# Altium schematic sheet ESC_D.SchDoc
size A3; SheetNumber: 10; SheetTotal: 10
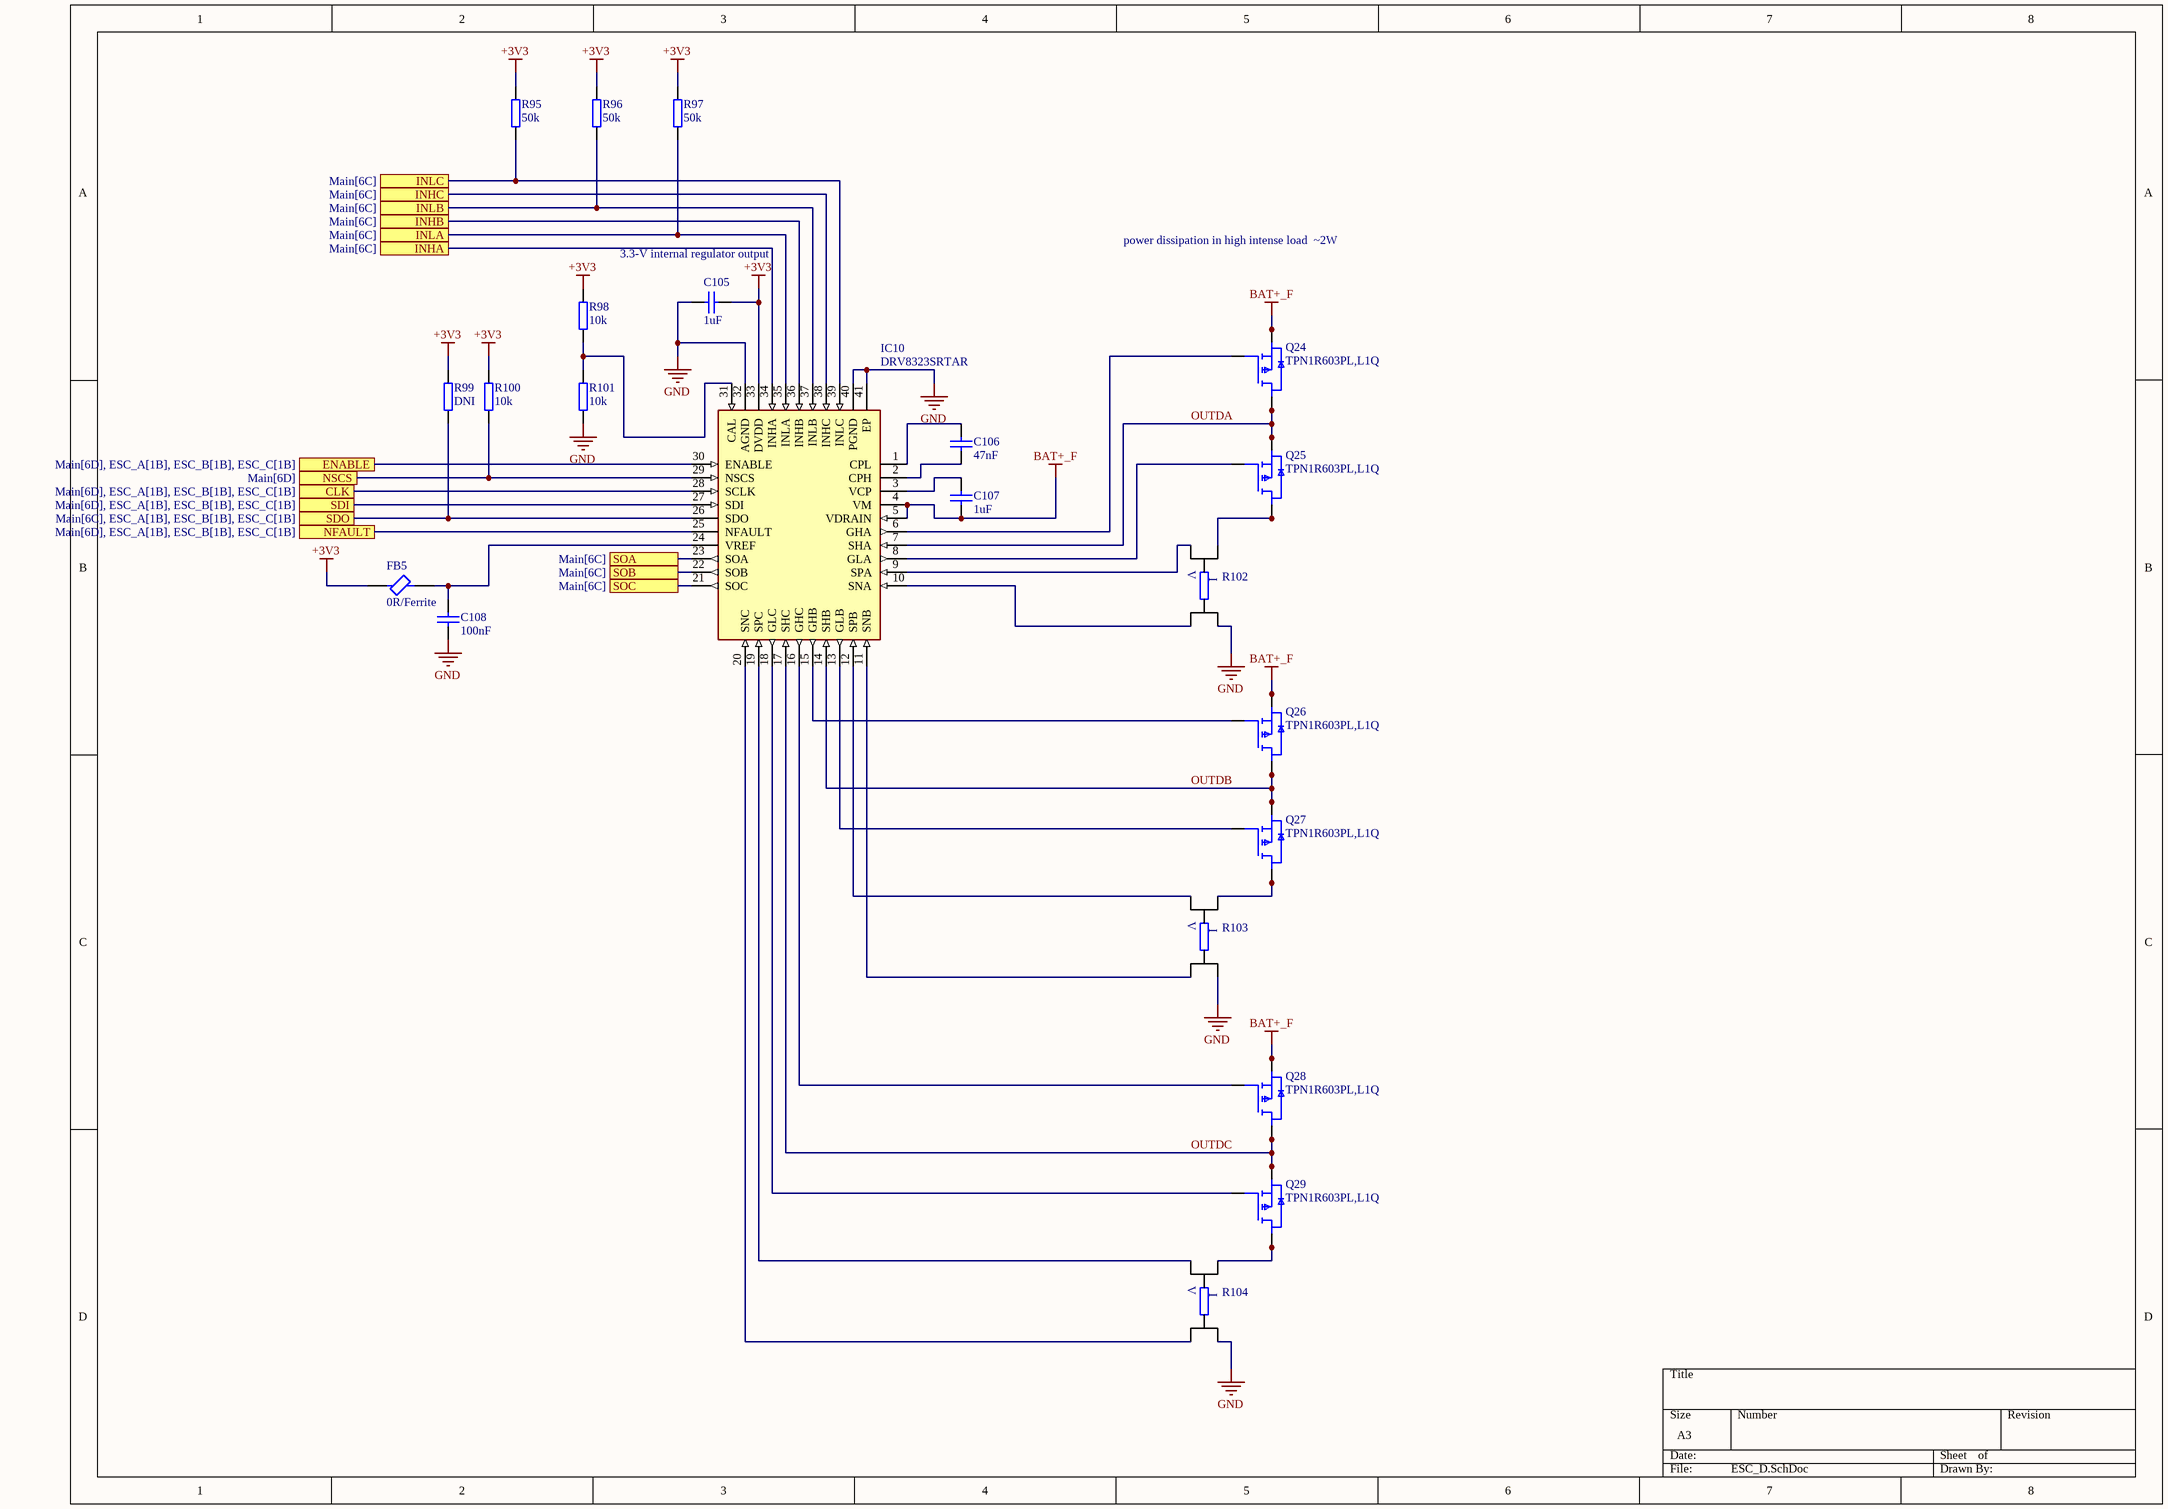
[diagram p0: ESC_D.SchDoc]

## Parts
C105  value 1uF  [CAP0402]  (hidden comment: Cap0402)
C106  value 47nF  [CAP0603]  (hidden comment: Cap0603)
C107  value 1uF  [CAP0603]  (hidden comment: Cap0603)
C108  value 100nF  [CAP0402]  (hidden comment: Cap0402)
FB5  0R/Ferrite  [NFZ15SG152SN10B]
IC10  DRV8323SRTAR  [QFN50P600X600X80-41N-D]
Q24  TPN1R603PL,L1Q  [TPN1R603PLL1Q]
Q25  TPN1R603PL,L1Q  [TPN1R603PLL1Q]
Q26  TPN1R603PL,L1Q  [TPN1R603PLL1Q]
Q27  TPN1R603PL,L1Q  [TPN1R603PLL1Q]
Q28  TPN1R603PL,L1Q  [TPN1R603PLL1Q]
Q29  TPN1R603PL,L1Q  [TPN1R603PLL1Q]
R95  value 50k  [RES0402]  (hidden comment: Res0402)
R96  value 50k  [RES0402]  (hidden comment: Res0402)
R97  value 50k  [RES0402]  (hidden comment: Res0402)
R98  value 10k  [RES0402]  (hidden comment: Res0402)
R99  value DNI  [RES0402]  (hidden comment: Res0402)
R100  value 10k  [RES0402]  (hidden comment: Res0402)
R101  value 10k  [RES0402]  (hidden comment: Res0402)
R102  WSK12161L000FEA  [WSK12161L000FEA]  (value not drawn)
R103  WSK12161L000FEA  [WSK12161L000FEA]  (value not drawn)
R104  WSK12161L000FEA  [WSK12161L000FEA]  (value not drawn)

## Ports
CLK (see Main[6D], ESC_A[1B], ESC_B[1B], ESC_C[1B]), ENABLE (see Main[6D], ESC_A[1B], ESC_B[1B], ESC_C[1B]), INHA (see Main[6C]), INHB (see Main[6C]), INHC (see Main[6C]), INLA (see Main[6C]), INLB (see Main[6C]), INLC (see Main[6C]), NFAULT (see Main[6D], ESC_A[1B], ESC_B[1B], ESC_C[1B]), NSCS (see Main[6D]), SDI (see Main[6D], ESC_A[1B], ESC_B[1B], ESC_C[1B]), SDO (see Main[6C], ESC_A[1B], ESC_B[1B], ESC_C[1B]), SOA (see Main[6C]), SOB (see Main[6C]), SOC (see Main[6C])

## Nets
+3V3: C105.2 FB5.1 IC10.33(DVDD) R95.2 R96.2 R97.2 R98.2 R99.2 R100.2
BAT+_F: C107.1 IC10.4(VM) IC10.5(VDRAIN) Q24.1(S_1) Q24.2(S_2) Q24.3(S_3) Q26.1(S_1) Q26.2(S_2) Q26.3(S_3) Q28.1(S_1) Q28.2(S_2) Q28.3(S_3)
GND: C105.1 C108.1 IC10.32(AGND) IC10.40(PGND) IC10.41(EP) R101.1 R102.4 R103.4 R104.4
CLK: IC10.28(SCLK) ; port CLK
ENABLE: IC10.30(ENABLE) ; port ENABLE
INHA: IC10.34(INHA) ; port INHA
INHB: IC10.36(INHB) ; port INHB
INHC: IC10.38(INHC) ; port INHC
INLA: IC10.35(INLA) R97.1 ; port INLA
INLB: IC10.37(INLB) R96.1 ; port INLB
INLC: IC10.39(INLC) R95.1 ; port INLC
NFAULT: IC10.25(NFAULT) ; port NFAULT
NSCS: IC10.29(NSCS) R100.1 ; port NSCS
OUTDA: IC10.7(SHA) Q24.5(D_1) Q24.6(D_2) Q24.7(D_3) Q24.8(D_4) Q24.9(D_4) Q25.1(S_1) Q25.2(S_2) Q25.3(S_3)
OUTDB: IC10.14(SHB) Q26.5(D_1) Q26.6(D_2) Q26.7(D_3) Q26.8(D_4) Q26.9(D_4) Q27.1(S_1) Q27.2(S_2) Q27.3(S_3)
OUTDC: IC10.17(SHC) Q28.5(D_1) Q28.6(D_2) Q28.7(D_3) Q28.8(D_4) Q28.9(D_4) Q29.1(S_1) Q29.2(S_2) Q29.3(S_3)
SDI: IC10.27(SDI) ; port SDI
SDO: IC10.26(SDO) R99.1 ; port SDO
SOA: IC10.23(SOA) ; port SOA
SOB: IC10.22(SOB) ; port SOB
SOC: IC10.21(SOC) ; port SOC
NetC106_1: C106.1 IC10.2(CPH)
NetC106_2: C106.2 IC10.1(CPL)
NetC107_2: C107.2 IC10.3(VCP)
NetC108_2: C108.2 FB5.2 IC10.24(VREF)
NetIC10_6: IC10.6(GHA) Q24.4(G)
NetIC10_8: IC10.8(GLA) Q25.4(G)
NetIC10_9: IC10.9(SPA) R102.2
NetIC10_10: IC10.10(SNA) R102.3
NetIC10_11: IC10.11(SNB) R103.3
NetIC10_12: IC10.12(SPB) R103.2
NetIC10_13: IC10.13(GLB) Q27.4(G)
NetIC10_15: IC10.15(GHB) Q26.4(G)
NetIC10_16: IC10.16(GHC) Q28.4(G)
NetIC10_18: IC10.18(GLC) Q29.4(G)
NetIC10_19: IC10.19(SPC) R104.2
NetIC10_20: IC10.20(SNC) R104.3
NetIC10_31: IC10.31(CAL) R98.1 R101.2
NetQ25_5: Q25.5(D_1) Q25.6(D_2) Q25.7(D_3) Q25.8(D_4) Q25.9(D_4) R102.1
NetQ27_5: Q27.5(D_1) Q27.6(D_2) Q27.7(D_3) Q27.8(D_4) Q27.9(D_4) R103.1
NetQ29_5: Q29.5(D_1) Q29.6(D_2) Q29.7(D_3) Q29.8(D_4) Q29.9(D_4) R104.1

## Notes on the sheet
- power dissipation in high intense load  ~2W
- 3.3-V internal regulator output
- (near IC10) Separate grounds?
- (in symbol WSK1216L5000FEA) V; I

## Library data of the parts
C105 = Cap0402: Manufacturer_Part_Number: GRM155R61H105KE05J; Voltage: 50V
C106 C107 = CapSMD0603: 50V; Published: 8-Jun-2000; LatestRevisionDate: 29-May-2009; LatestRevisionNote: IPC-7351 Footprint Added.; PackageReference: C1206; Publisher: Altium Limited; PackageDescription: Chip Capacitor
C108 = Cap0402: Manufacturer_Part_Number: GRM155R71H104ME14D; Voltage: 50V
FB5 = BLM15PE471SH1D: Ferrite Bead; Manufacturer_Name: Murata Electronics; Datasheet Link: https://www.murata.com/en-global/products/productdetail.aspx?cate=luNoiseSupprFilteChipFerriBead&partno=BLM15PE471SH1%23; Height: 0.55mm; Manufacturer_Part_Number: BLM15PE471SH1D; Mouser Part Number: 81-BLM15PE471SH1D; Mouser Price/Stock: https://www.mouser.co.uk/ProductDetail/Murata-Electronics/BLM15PE471SH1D?qs=DRkmTr78QATAY5qAVx1hGA%3D%3D
IC10 = DRV8323SRTAR: Integrated Circuit; Manufacturer_Name: Texas Instruments; Datasheet Link: http://www.ti.com/lit/ds/symlink/drv8323.pdf; Height: 0.8mm; Manufacturer_Part_Number: DRV8323SRTAR; Mouser Part Number: 595-DRV8323SRTAR; Mouser Price/Stock: https://www.mouser.co.uk/ProductDetail/Texas-Instruments/DRV8323SRTAR?qs=u4fy%2FsgLU9P2gpPTX6mffg%3D%3D; Arrow Part Number: DRV8323SRTAR; Arrow Price/Stock: https://www.arrow.com/en/products/drv8323srtar/texas-instruments?utm_currency=USD&region=nac
Q24-Q29 = TPN1R603PL,L1Q: MOSFET (N-Channel); Manufacturer_Name: Toshiba; Datasheet Link: https://toshiba.semicon-storage.com/ap-en/semiconductor/product/mosfets/12v-300v-mosfets/detail.TPN1R603PL.html; Height: 0.9mm; Manufacturer_Part_Number: TPN1R603PL,L1Q; Mouser Part Number: 757-TPN1R603PLL1Q; Mouser Price/Stock: https://www.mouser.co.uk/ProductDetail/Toshiba/TPN1R603PLL1Q?qs=bUPhaerQQeGYpGlYi%252BLguw%3D%3D; Arrow Part Number: TPN1R603PL,L1Q; Arrow Price/Stock: https://www.arrow.com/en/products/tpn1r603pll1q/toshiba?utm_currency=USD&region=nac
R95-R97 = Res0402: Manufacturer_Part_Number: TNPW040249K9DEED
R98 R100 R101 = Res0402: Manufacturer_Part_Number: ERA-2AED103X
R102-R104 = WSK1216L5000FEA: Resistor; Manufacturer_Name: Vishay; Datasheet Link: http://www.vishay.com/docs/30189/wsk1216.pdf; Height: 1.9mm; Manufacturer_Part_Number: WSK1216L5000FEA; Mouser Part Number: 71-WSK1216L5000FEA; Mouser Price/Stock: https://www.mouser.co.uk/ProductDetail/Vishay-Dale/WSK1216L5000FEA?qs=OlC7AqGiEDlM2wGD42LFoQ%3D%3D; Arrow Part Number: WSK1216L5000FEA; Arrow Price/Stock: https://www.arrow.com/en/products/wsk1216l5000fea/vishay?region=nac